# Altium schematic sheet SD Card.SchDoc
size A4; SheetNumber: 5; SheetTotal: 9
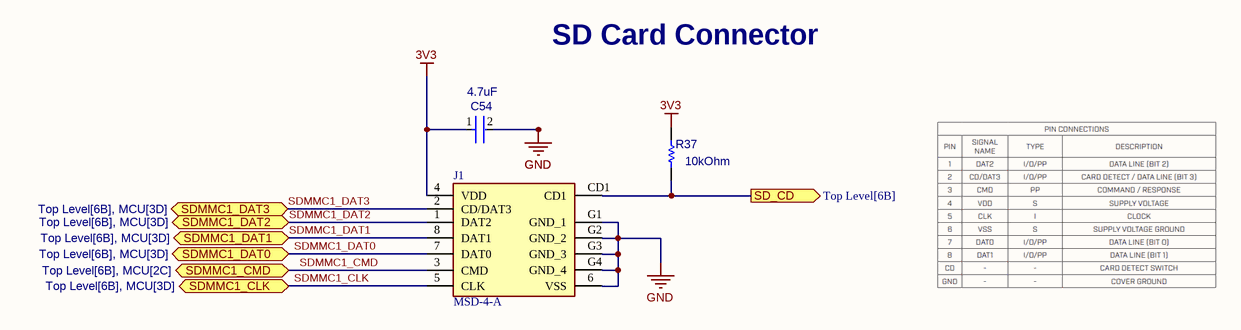
[diagram p0: SD Card.SchDoc]

## Parts
C54  CC0603KRX7R9BB103  [FP-CC0603-DA-MFG]  (value not drawn)
J1  MSD-4-A  [MSD4A]
R37  RC0603JR-070RL  [RESC1608X55X25ML10T15]  (value not drawn)

## Ports
SD_CD (out, see Top Level[6B]), SDMMC1_CLK (bidir, see Top Level[6B], MCU[3D]), SDMMC1_CMD (bidir, see Top Level[6B], MCU[2C]), SDMMC1_DAT0 (bidir, see Top Level[6B], MCU[3D]), SDMMC1_DAT1 (bidir, see Top Level[6B], MCU[3D]), SDMMC1_DAT2 (bidir, see Top Level[6B], MCU[3D]), SDMMC1_DAT3 (bidir, see Top Level[6B], MCU[3D])

## Nets
3V3: C54.1 J1.4(VDD) R37.1
GND: C54.2 J1.6(VSS) J1.G1(GND_1) J1.G2(GND_2) J1.G3(GND_3) J1.G4(GND_4)
SD_CD: J1.CD1 R37.2 ; port SD_CD
SDMMC1_CLK: J1.5(CLK) ; port SDMMC1_CLK
SDMMC1_CMD: J1.3(CMD) ; port SDMMC1_CMD
SDMMC1_DAT0: J1.7(DAT0) ; port SDMMC1_DAT0
SDMMC1_DAT1: J1.8(DAT1) ; port SDMMC1_DAT1
SDMMC1_DAT2: J1.1(DAT2) ; port SDMMC1_DAT2
SDMMC1_DAT3: J1.2(CD/DAT3) ; port SDMMC1_DAT3

## Notes on the sheet
- SD Card Connector
- (near C54) 4.7uF
- (near R37) 10kOhm

## Library data of the parts
C54 = CMP-2100-03600-2: CAP CER 10000PF 50V X7R 0603; Manufacturer: YAGEO; Tolerance: 0.1; Material: Ceramic; Temperature Coefficient: 15%; Value: 10 nF; Mouser Description: Multilayer Ceramic Capacitor, CC Series, 0.01 - F, - 10%, X7R, 50 V, 0603 [1608 Metric]; Digikey Description: CAP CER 10000PF 50V X7R 0603; Height: 0.9mm; Category: Cap; Temperature Characteristic: X7R; Footprint Url: http://www.yageo.com/exep/pages/download/literatures/UPY-C_GEN_24.pdf; Lead Free: Yes; Voltage Rating: 50 V; Manufacturer Part Number: CC0603KRX7R9BB103; Temperature: -55°C to +125°C; Device Class L3: Ceramic Capacitors; ComponentLink2Description: Datasheet; Voltage: 50 V; Package: CC0603-DA; Octopart: https://octopart.com/cc0603krx7r9bb103-yageo-192938; Automotive: No; Temperature Range High: +125°C; Temperature Range Low: -55°C; RoHS: TRUE; Device Class L1: Passive Components; ComponentLink2URL: http://www.yageo.com/documents/recent/UPY-GPHC_X7R_6.3V-to-50V_18.pdf; Device Class L2: Capacitors; Capacitance: 10 nF
J1 = MSD-4-A: Connector; Manufacturer_Name: Same Sky; Datasheet Link: https://www.sameskydevices.com/product/resource/msd-4-a.pdf; Height: 2mm; Manufacturer_Part_Number: MSD-4-A; Mouser Part Number: 179-MSD-4-A; Mouser Price/Stock: https://www.mouser.co.uk/ProductDetail/Same-Sky/MSD-4-A?qs=Z%252BL2brAPG1Jll%252BQTi%252Btupg%3D%3D; Arrow Part Number: MSD-4-A; Arrow Price/Stock: https://www.arrow.com/en/products/msd-4-a/cui-devices?utm_currency=USD&region=nac
R37 = CMP-2100-03667-1: Chip Resistor, 0 Ohm, +/- 5%, 0.1 W, -55 to 155 degC, 0603 (1608 Metric), RoHS, Tape and Reel; Manufacturer: Yageo; Temperature Coefficient: 200ppm/degreesC; Voltage Rating: 50V; Power Rating: 100mW; Resistance: 0mOhm; Width: 0.8mm; Max Operating Temperature: 155degC; Tolerance: 5%; Package Reference: 0603; Height: 0.45mm; Depth: 0.8mm; Package Description: 2-Pin Surface Mount Device, Body 1.6 x 0.8 mm; Termination: SMD/SMT; Package Quantity: 5000; Case/Package: 0603; Case Code (Imperial): 0603; Radiation Hardening: No; Number of Pins: 2; Length: 1.6mm; Lead Free: LeadFree; Voltage Rating (DC): 50V; Military Standard: Not; Datasheet URL: http://www.yageo.com/NewPortal/yageodocoutput?fileName=/pdf/R-Chip/PYu-RC_Group_51_RoHS_L_5.pdf; Manufacturer URL: http://www.yageo.com/; Packaging: TapeandReel; Case Code (Metric): 1608; Min Operating Temperature: -55degC; Composition: ThickFilm; RoHSCompliant: true; Contact Plating: Tin; Datasheet Version: Rev. 5, 10/2016; REACH SVHC: NoSVHC